# Altium project RK_NVR_DEMO1_RK3588_LP4XD200P232SD8_V21_20211228.PrjPcb (part 16 of 19)

## Sheet 83.SATA-SATA PM1.SchDoc
size 594 x 420 mm; Revision: V2.1; Schematic Page Number: 11; Page Number: 35; Check: Default; Schematic Name: RK_NVR_DEMO1_RK3588_LP4/4x_V21; Page Count: 43; Page name: 83.SATA-SATA PM1; Designer: Zhangdz; Schematic Page Count: 99; Revcode: V2.1; DsnPath: E:\Work\SBER\RK3588_SOM\temp\RK_NVR_DEMO1_RK3588_LP4XD200P232SD8_V21_20211228.DSN; SchematicName: RK_NVR_DEMO1_RK3588_LP4/4x_V21; PageName: 83.SATA-SATA PM1; PageSize: A2; TopSchematic: True
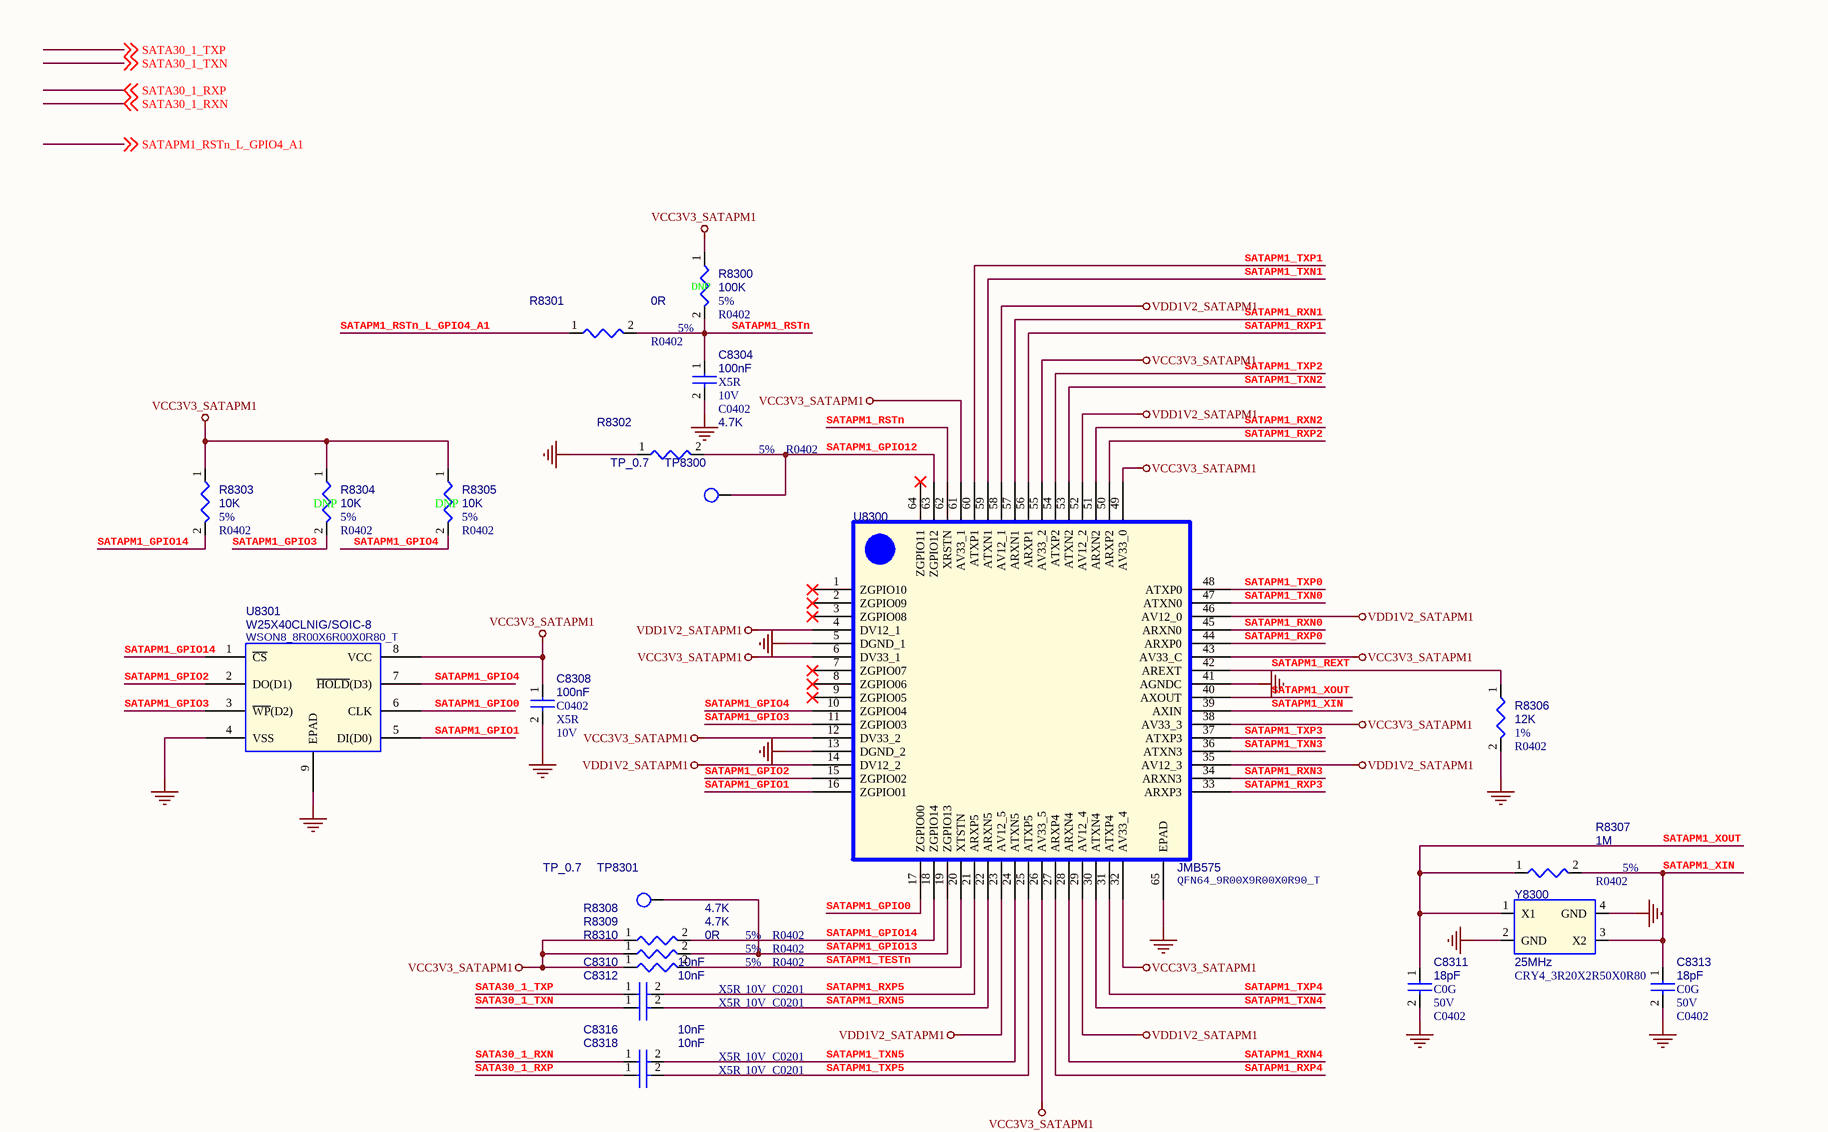
[diagram p65: 83.SATA-SATA PM1.SchDoc, top left]
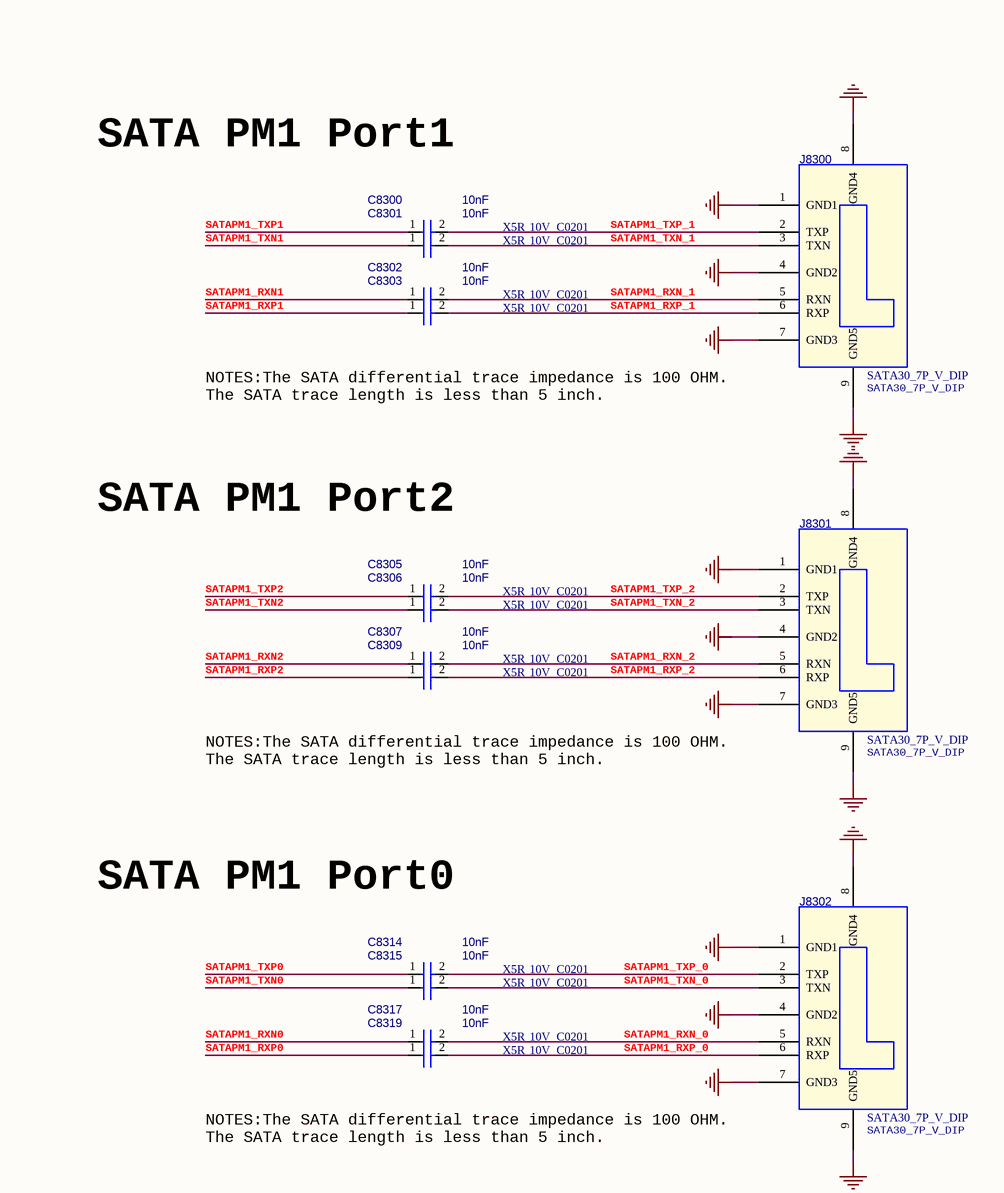
[diagram p66: 83.SATA-SATA PM1.SchDoc, top right]
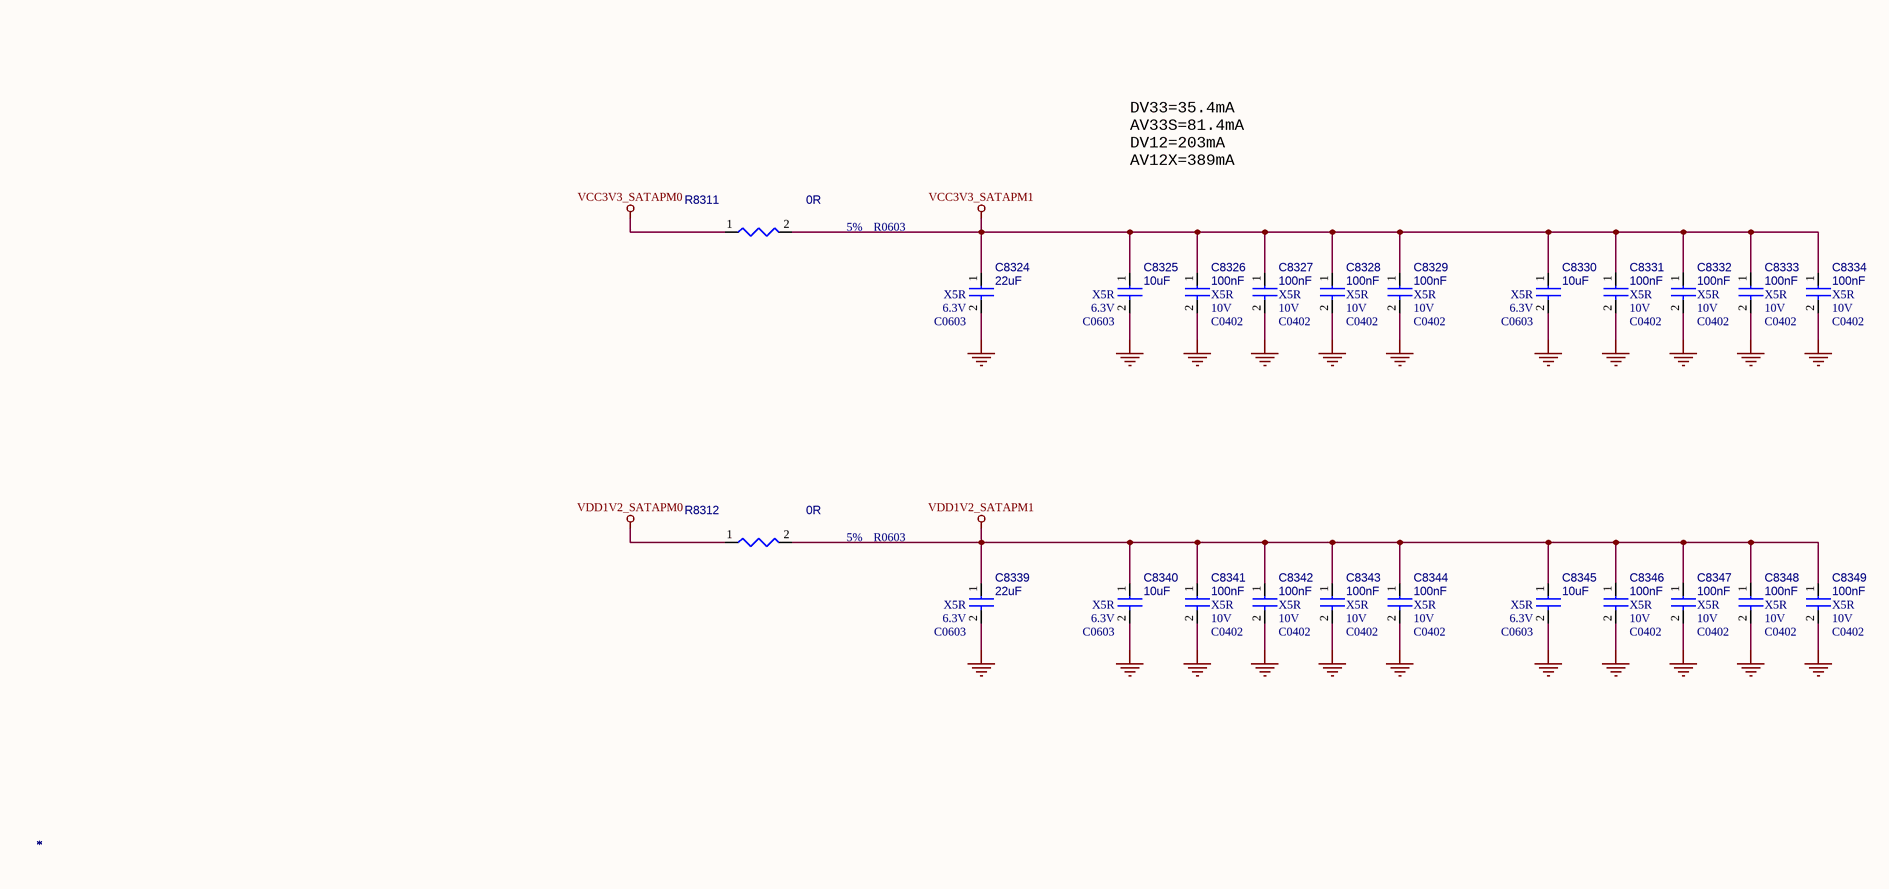
[diagram p67: 83.SATA-SATA PM1.SchDoc, bottom left]
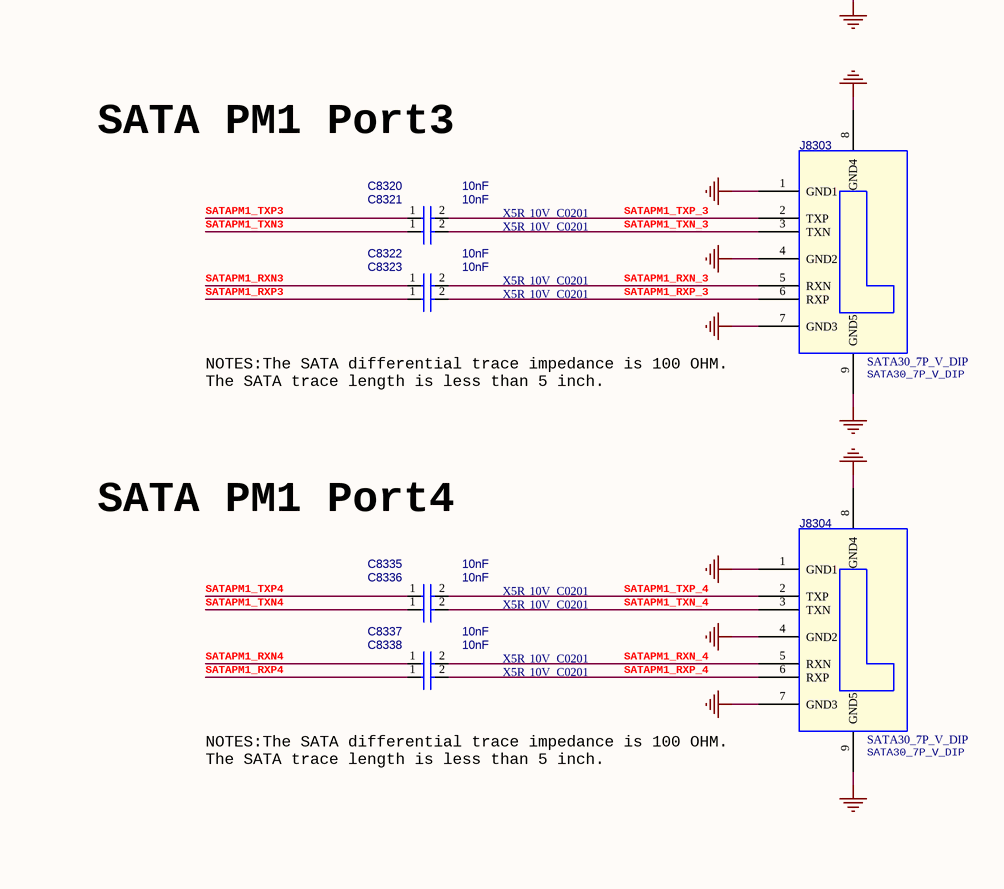
[diagram p68: 83.SATA-SATA PM1.SchDoc, bottom right]

### Parts
C8300  *  Voltage: 10V  Dielectric: X5R  [C0201]
C8301  *  Voltage: 10V  Dielectric: X5R  [C0201]
C8302  *  Voltage: 10V  Dielectric: X5R  [C0201]
C8303  *  Voltage: 10V  Dielectric: X5R  [C0201]
C8304  *  Voltage: 10V  Dielectric: X5R  [C0402]
C8305  *  Voltage: 10V  Dielectric: X5R  [C0201]
C8306  *  Voltage: 10V  Dielectric: X5R  [C0201]
C8307  *  Voltage: 10V  Dielectric: X5R  [C0201]
C8308  *  Voltage: 10V  Dielectric: X5R  [C0402]
C8309  *  Voltage: 10V  Dielectric: X5R  [C0201]
C8310  *  Voltage: 10V  Dielectric: X5R  [C0201]
C8311  *  Voltage: 50V  Dielectric: C0G  [C0402]
C8312  *  Voltage: 10V  Dielectric: X5R  [C0201]
C8313  *  Voltage: 50V  Dielectric: C0G  [C0402]
C8314  *  Voltage: 10V  Dielectric: X5R  [C0201]
C8315  *  Voltage: 10V  Dielectric: X5R  [C0201]
C8316  *  Voltage: 10V  Dielectric: X5R  [C0201]
C8317  *  Voltage: 10V  Dielectric: X5R  [C0201]
C8318  *  Voltage: 10V  Dielectric: X5R  [C0201]
C8319  *  Voltage: 10V  Dielectric: X5R  [C0201]
C8320  *  Voltage: 10V  Dielectric: X5R  [C0201]
C8321  *  Voltage: 10V  Dielectric: X5R  [C0201]
C8322  *  Voltage: 10V  Dielectric: X5R  [C0201]
C8323  *  Voltage: 10V  Dielectric: X5R  [C0201]
C8324  *  Voltage: 6.3V  Dielectric: X5R  [C0603]
C8325  *  Voltage: 6.3V  Dielectric: X5R  [C0603]
C8326  *  Voltage: 10V  Dielectric: X5R  [C0402]
C8327  *  Voltage: 10V  Dielectric: X5R  [C0402]
C8328  *  Voltage: 10V  Dielectric: X5R  [C0402]
C8329  *  Voltage: 10V  Dielectric: X5R  [C0402]
C8330  *  Voltage: 6.3V  Dielectric: X5R  [C0603]
C8331  *  Voltage: 10V  Dielectric: X5R  [C0402]
C8332  *  Voltage: 10V  Dielectric: X5R  [C0402]
C8333  *  Voltage: 10V  Dielectric: X5R  [C0402]
C8334  *  Voltage: 10V  Dielectric: X5R  [C0402]
C8335  *  Voltage: 10V  Dielectric: X5R  [C0201]
C8336  *  Voltage: 10V  Dielectric: X5R  [C0201]
C8337  *  Voltage: 10V  Dielectric: X5R  [C0201]
C8338  *  Voltage: 10V  Dielectric: X5R  [C0201]
C8339  *  Voltage: 6.3V  Dielectric: X5R  [C0603]
C8340  *  Voltage: 6.3V  Dielectric: X5R  [C0603]
C8341  *  Voltage: 10V  Dielectric: X5R  [C0402]
C8342  *  Voltage: 10V  Dielectric: X5R  [C0402]
C8343  *  Voltage: 10V  Dielectric: X5R  [C0402]
C8344  *  Voltage: 10V  Dielectric: X5R  [C0402]
C8345  *  Voltage: 6.3V  Dielectric: X5R  [C0603]
C8346  *  Voltage: 10V  Dielectric: X5R  [C0402]
C8347  *  Voltage: 10V  Dielectric: X5R  [C0402]
C8348  *  Voltage: 10V  Dielectric: X5R  [C0402]
C8349  *  Voltage: 10V  Dielectric: X5R  [C0402]
J8300  *  [SATA30_7P_V_DIP]
J8301  *  [SATA30_7P_V_DIP]
J8302  *  [SATA30_7P_V_DIP]
J8303  *  [SATA30_7P_V_DIP]
J8304  *  [SATA30_7P_V_DIP]
R8300  *  Tolerance: 5%  Option: DNP  [R0402]
R8301  *  Tolerance: 5%  [R0402]
R8302  *  Tolerance: 5%  [R0402]
R8303  *  Tolerance: 5%  [R0402]
R8304  *  Tolerance: 5%  Option: DNP  [R0402]
R8305  *  Tolerance: 5%  Option: DNP  [R0402]
R8306  *  Tolerance: 1%  [R0402]
R8307  *  Tolerance: 5%  [R0402]
R8308  *  Tolerance: 5%  [R0402]
R8309  *  Tolerance: 5%  [R0402]
R8310  *  Tolerance: 5%  [R0402]
R8311  *  PCB Footprint: R0603  Tolerance: 5%  [R0402]
R8312  *  PCB Footprint: R0603  Tolerance: 5%  [R0402]
TP8300  *  [TEST]
TP8301  *  [TEST]
U8300  *  PCB Footprint: QFN64_9R00X9R00X0R90_T  [QFN64]
U8301  *  [WSON8_8R00X6R00X0R80_T]
Y8300  *  PCB Footprint: CRY4_3R20X2R50X0R80  [CRY-3225]

### Nets
GND: C8304.2 C8308.2 C8311.2 C8313.2 C8324.2 C8325.2 C8326.2 C8327.2 C8328.2 C8329.2 C8330.2 C8331.2 C8332.2 C8333.2 C8334.2 C8339.2 C8340.2 C8341.2 C8342.2 C8343.2 C8344.2 C8345.2 C8346.2 C8347.2 C8348.2 C8349.2 J8300.1(GND1) J8300.4(GND2) J8300.7(GND3) J8300.8(GND4) J8300.9(GND5) J8301.1(GND1) J8301.4(GND2) J8301.7(GND3) J8301.8(GND4) J8301.9(GND5) J8302.1(GND1) J8302.4(GND2) J8302.7(GND3) J8302.8(GND4) J8302.9(GND5) J8303.1(GND1) J8303.4(GND2) J8303.7(GND3) J8303.8(GND4) J8303.9(GND5) J8304.1(GND1) J8304.4(GND2) J8304.7(GND3) J8304.8(GND4) J8304.9(GND5) R8302.1 R8306.2 U8300.5(DGND_1) U8300.13(DGND_2) U8300.41(AGNDC) U8300.65(EPAD) U8301.4(VSS) U8301.9(EPAD) Y8300.2(GND) Y8300.4(GND)
VCC3V3_SATAPM0: R8311.1
VCC3V3_SATAPM1: C8308.1 C8324.1 C8325.1 C8326.1 C8327.1 C8328.1 C8329.1 C8330.1 C8331.1 C8332.1 C8333.1 C8334.1 R8300.1 R8303.1 R8304.1 R8305.1 R8308.1 R8309.1 R8310.1 R8311.2 U8300.6(DV33_1) U8300.12(DV33_2) U8300.26(AV33_5) U8300.32(AV33_4) U8300.38(AV33_3) U8300.43(AV33_C) U8300.49(AV33_0) U8300.55(AV33_2) U8300.61(AV33_1) U8301.8(VCC)
VDD1V2_SATAPM0: R8312.1
VDD1V2_SATAPM1: C8339.1 C8340.1 C8341.1 C8342.1 C8343.1 C8344.1 C8345.1 C8346.1 C8347.1 C8348.1 C8349.1 R8312.2 U8300.4(DV12_1) U8300.14(DV12_2) U8300.23(AV12_5) U8300.29(AV12_4) U8300.35(AV12_3) U8300.46(AV12_0) U8300.52(AV12_2) U8300.58(AV12_1)
SATA30_1_RXN: C8316.1 ; off-sheet SATA30_1_RXN
SATA30_1_RXP: C8318.1 ; off-sheet SATA30_1_RXP
SATA30_1_TXN: C8312.1 ; off-sheet SATA30_1_TXN
SATA30_1_TXP: C8310.1 ; off-sheet SATA30_1_TXP
SATAPM1_GPIO0: U8300.17(ZGPIO00) U8301.6(CLK)
SATAPM1_GPIO1: U8300.16(ZGPIO01) U8301.5(DI(D0))
SATAPM1_GPIO2: U8300.15(ZGPIO02) U8301.2(DO(D1))
SATAPM1_GPIO3: R8304.2 U8300.11(ZGPIO03) U8301.3(~{WP}(D2))
SATAPM1_GPIO4: R8305.2 U8300.10(ZGPIO04) U8301.7(~{HOLD}(D3))
SATAPM1_GPIO12: R8302.2 TP8300.1 U8300.63(ZGPIO12)
SATAPM1_GPIO13: R8309.2 TP8301.1 U8300.19(ZGPIO13)
SATAPM1_GPIO14: R8303.2 R8308.2 U8300.18(ZGPIO14) U8301.1(~{CS})
SATAPM1_REXT: R8306.1 U8300.42(AREXT)
SATAPM1_RSTn: C8304.1 R8300.2 R8301.2 U8300.62(XRSTN)
SATAPM1_RSTn_L_GPIO4_A1: R8301.1 ; off-sheet SATAPM1_RSTn_L_GPIO4_A1
SATAPM1_RXN0: C8317.1 U8300.45(ARXN0)
SATAPM1_RXN1: C8302.1 U8300.57(ARXN1)
SATAPM1_RXN2: C8307.1 U8300.51(ARXN2)
SATAPM1_RXN3: C8322.1 U8300.34(ARXN3)
SATAPM1_RXN4: C8337.1 U8300.28(ARXN4)
SATAPM1_RXN5: C8312.2 U8300.22(ARXN5)
SATAPM1_RXN_0: C8317.2 J8302.5(RXN)
SATAPM1_RXN_1: C8302.2 J8300.5(RXN)
SATAPM1_RXN_2: C8307.2 J8301.5(RXN)
SATAPM1_RXN_3: C8322.2 J8303.5(RXN)
SATAPM1_RXN_4: C8337.2 J8304.5(RXN)
SATAPM1_RXP0: C8319.1 U8300.44(ARXP0)
SATAPM1_RXP1: C8303.1 U8300.56(ARXP1)
SATAPM1_RXP2: C8309.1 U8300.50(ARXP2)
SATAPM1_RXP3: C8323.1 U8300.33(ARXP3)
SATAPM1_RXP4: C8338.1 U8300.27(ARXP4)
SATAPM1_RXP5: C8310.2 U8300.21(ARXP5)
SATAPM1_RXP_0: C8319.2 J8302.6(RXP)
SATAPM1_RXP_1: C8303.2 J8300.6(RXP)
SATAPM1_RXP_2: C8309.2 J8301.6(RXP)
SATAPM1_RXP_3: C8323.2 J8303.6(RXP)
SATAPM1_RXP_4: C8338.2 J8304.6(RXP)
SATAPM1_TESTn: R8310.2 U8300.20(XTSTN)
SATAPM1_TXN0: C8315.1 U8300.47(ATXN0)
SATAPM1_TXN1: C8301.1 U8300.59(ATXN1)
SATAPM1_TXN2: C8306.1 U8300.53(ATXN2)
SATAPM1_TXN3: C8321.1 U8300.36(ATXN3)
SATAPM1_TXN4: C8336.1 U8300.30(ATXN4)
SATAPM1_TXN5: C8316.2 U8300.24(ATXN5)
SATAPM1_TXN_0: C8315.2 J8302.3(TXN)
SATAPM1_TXN_1: C8301.2 J8300.3(TXN)
SATAPM1_TXN_2: C8306.2 J8301.3(TXN)
SATAPM1_TXN_3: C8321.2 J8303.3(TXN)
SATAPM1_TXN_4: C8336.2 J8304.3(TXN)
SATAPM1_TXP0: C8314.1 U8300.48(ATXP0)
SATAPM1_TXP1: C8300.1 U8300.60(ATXP1)
SATAPM1_TXP2: C8305.1 U8300.54(ATXP2)
SATAPM1_TXP3: C8320.1 U8300.37(ATXP3)
SATAPM1_TXP4: C8335.1 U8300.31(ATXP4)
SATAPM1_TXP5: C8318.2 U8300.25(ATXP5)
SATAPM1_TXP_0: C8314.2 J8302.2(TXP)
SATAPM1_TXP_1: C8300.2 J8300.2(TXP)
SATAPM1_TXP_2: C8305.2 J8301.2(TXP)
SATAPM1_TXP_3: C8320.2 J8303.2(TXP)
SATAPM1_TXP_4: C8335.2 J8304.2(TXP)
SATAPM1_XIN: C8313.1 R8307.2 U8300.39(AXIN) Y8300.3(X2)
SATAPM1_XOUT: C8311.1 R8307.1 U8300.40(AXOUT) Y8300.1(X1)

Not connected (* = marked no-connect by the designer): U8300 1(ZGPIO10)* 2(ZGPIO09)* 3(ZGPIO08)* 7(ZGPIO07)* 8(ZGPIO06)* 9(ZGPIO05)* 64(ZGPIO11)*

### Notes on the sheet
- SATA PM1 Port1
- (near J8300) NOTES:The SATA differential trace impedance is 100 OHM.
  The SATA trace length is less than 5 inch.
- SATA PM1 Port2
- (near J8301) NOTES:The SATA differential trace impedance is 100 OHM.
  The SATA trace length is less than 5 inch.
- SATA PM1 Port0
- (near J8302) NOTES:The SATA differential trace impedance is 100 OHM.
  The SATA trace length is less than 5 inch.
- SATA PM1 Port3
- DV33=35.4mA
  AV33S=81.4mA
  DV12=203mA
  AV12X=389mA
- (near J8303) NOTES:The SATA differential trace impedance is 100 OHM.
  The SATA trace length is less than 5 inch.
- SATA PM1 Port4
- (near J8304) NOTES:The SATA differential trace impedance is 100 OHM.
  The SATA trace length is less than 5 inch.

### Library data of the parts
C8300 = CAP NP: cap,10.00nF,+/-10%,10V,X5R,C0201; Part Reference: C8300; Manufacturer PN: C0603X5R1A103K030BA; Manufacturer: TDK; Value: 10nF; Tolerance: 10%; Priority: A; PCB Footprint: C0201; Created by: JJJ; Part Type: C0201; RK PN: C0603X5R1A103K030BA
C8301 = CAP NP: cap,10.00nF,+/-10%,10V,X5R,C0201; Part Reference: C8301; Manufacturer PN: C0603X5R1A103K030BA; Manufacturer: TDK; Value: 10nF; Tolerance: 10%; Priority: A; PCB Footprint: C0201; Created by: JJJ; Part Type: C0201; RK PN: C0603X5R1A103K030BA
C8302 = CAP NP: cap,10.00nF,+/-10%,10V,X5R,C0201; Part Reference: C8302; Manufacturer PN: C0603X5R1A103K030BA; Manufacturer: TDK; Value: 10nF; Tolerance: 10%; Priority: A; PCB Footprint: C0201; Created by: JJJ; Part Type: C0201; RK PN: C0603X5R1A103K030BA
C8303 = CAP NP: cap,10.00nF,+/-10%,10V,X5R,C0201; Part Reference: C8303; Manufacturer PN: C0603X5R1A103K030BA; Manufacturer: TDK; Value: 10nF; Tolerance: 10%; Priority: A; PCB Footprint: C0201; Created by: JJJ; Part Type: C0201; RK PN: C0603X5R1A103K030BA
C8304 = CAP NP: cap,100.00nF,+/-10%,10V,X5R,C0402; Part Reference: C8304; Manufacturer: TDK; Value: 100nF; RK PN: C1005X5R1A104K050BA; Priority: A; Tolerance: 10%; PCB Footprint: C0402; Part Type: C0402; Manufacturer PN: C1005X5R1A104K050BA; Created by: JJJ
C8305 = CAP NP: cap,10.00nF,+/-10%,10V,X5R,C0201; Part Reference: C8305; Manufacturer PN: C0603X5R1A103K030BA; Manufacturer: TDK; Value: 10nF; Tolerance: 10%; Priority: A; PCB Footprint: C0201; Created by: JJJ; Part Type: C0201; RK PN: C0603X5R1A103K030BA
C8306 = CAP NP: cap,10.00nF,+/-10%,10V,X5R,C0201; Part Reference: C8306; Manufacturer PN: C0603X5R1A103K030BA; Manufacturer: TDK; Value: 10nF; Tolerance: 10%; Priority: A; PCB Footprint: C0201; Created by: JJJ; Part Type: C0201; RK PN: C0603X5R1A103K030BA
C8307 = CAP NP: cap,10.00nF,+/-10%,10V,X5R,C0201; Part Reference: C8307; Manufacturer PN: C0603X5R1A103K030BA; Manufacturer: TDK; Value: 10nF; Tolerance: 10%; Priority: A; PCB Footprint: C0201; Created by: JJJ; Part Type: C0201; RK PN: C0603X5R1A103K030BA
C8308 = CAP NP: cap,100.00nF,+/-10%,10V,X5R,C0402; Part Reference: C8308; Manufacturer: TDK; Value: 100nF; RK PN: C1005X5R1A104K050BA; Priority: A; Tolerance: 10%; PCB Footprint: C0402; Part Type: C0402; Manufacturer PN: C1005X5R1A104K050BA; Created by: JJJ
C8309 = CAP NP: cap,10.00nF,+/-10%,10V,X5R,C0201; Part Reference: C8309; Manufacturer PN: C0603X5R1A103K030BA; Manufacturer: TDK; Value: 10nF; Tolerance: 10%; Priority: A; PCB Footprint: C0201; Created by: JJJ; Part Type: C0201; RK PN: C0603X5R1A103K030BA
C8310 = CAP NP: cap,10.00nF,+/-10%,10V,X5R,C0201; Part Reference: C8310; Manufacturer: TDK; Value: 10nF; RK PN: C0603X5R1A103K030BA; Priority: A; Tolerance: 10%; PCB Footprint: C0201; Part Type: C0201; Manufacturer PN: C0603X5R1A103K030BA; Created by: JJJ
C8311 = CAP NP: cap,18.00pF,+/-5%,50V,C0G,C0402; Part Reference: C8311; Manufacturer: TDK; Value: 18pF; RK PN: C1005C0G1H180J050BA; Priority: A; Tolerance: 5%; PCB Footprint: C0402; Part Type: C0402; Manufacturer PN: C1005C0G1H180J050BA; Created by: JJJ
C8312 = CAP NP: cap,10.00nF,+/-10%,10V,X5R,C0201; Part Reference: C8312; Manufacturer: TDK; Value: 10nF; RK PN: C0603X5R1A103K030BA; Priority: A; Tolerance: 10%; PCB Footprint: C0201; Part Type: C0201; Manufacturer PN: C0603X5R1A103K030BA; Created by: JJJ
C8313 = CAP NP: cap,18.00pF,+/-5%,50V,C0G,C0402; Part Reference: C8313; Manufacturer: TDK; Value: 18pF; RK PN: C1005C0G1H180J050BA; Priority: A; Tolerance: 5%; PCB Footprint: C0402; Part Type: C0402; Manufacturer PN: C1005C0G1H180J050BA; Created by: JJJ
C8314 = CAP NP: cap,10.00nF,+/-10%,10V,X5R,C0201; Part Reference: C8314; Manufacturer PN: C0603X5R1A103K030BA; Manufacturer: TDK; Value: 10nF; Tolerance: 10%; Priority: A; PCB Footprint: C0201; Created by: JJJ; Part Type: C0201; RK PN: C0603X5R1A103K030BA
C8315 = CAP NP: cap,10.00nF,+/-10%,10V,X5R,C0201; Part Reference: C8315; Manufacturer PN: C0603X5R1A103K030BA; Manufacturer: TDK; Value: 10nF; Tolerance: 10%; Priority: A; PCB Footprint: C0201; Created by: JJJ; Part Type: C0201; RK PN: C0603X5R1A103K030BA
C8316 = CAP NP: cap,10.00nF,+/-10%,10V,X5R,C0201; Part Reference: C8316; Manufacturer: TDK; Value: 10nF; RK PN: C0603X5R1A103K030BA; Priority: A; Tolerance: 10%; PCB Footprint: C0201; Part Type: C0201; Manufacturer PN: C0603X5R1A103K030BA; Created by: JJJ
C8317 = CAP NP: cap,10.00nF,+/-10%,10V,X5R,C0201; Part Reference: C8317; Manufacturer PN: C0603X5R1A103K030BA; Manufacturer: TDK; Value: 10nF; Tolerance: 10%; Priority: A; PCB Footprint: C0201; Created by: JJJ; Part Type: C0201; RK PN: C0603X5R1A103K030BA
C8318 = CAP NP: cap,10.00nF,+/-10%,10V,X5R,C0201; Part Reference: C8318; Manufacturer: TDK; Value: 10nF; RK PN: C0603X5R1A103K030BA; Priority: A; Tolerance: 10%; PCB Footprint: C0201; Part Type: C0201; Manufacturer PN: C0603X5R1A103K030BA; Created by: JJJ
C8319 = CAP NP: cap,10.00nF,+/-10%,10V,X5R,C0201; Part Reference: C8319; Manufacturer PN: C0603X5R1A103K030BA; Manufacturer: TDK; Value: 10nF; Tolerance: 10%; Priority: A; PCB Footprint: C0201; Created by: JJJ; Part Type: C0201; RK PN: C0603X5R1A103K030BA
C8320 = CAP NP: cap,10.00nF,+/-10%,10V,X5R,C0201; Part Reference: C8320; Manufacturer PN: C0603X5R1A103K030BA; Manufacturer: TDK; Value: 10nF; Tolerance: 10%; Priority: A; PCB Footprint: C0201; Created by: JJJ; Part Type: C0201; RK PN: C0603X5R1A103K030BA
C8321 = CAP NP: cap,10.00nF,+/-10%,10V,X5R,C0201; Part Reference: C8321; Manufacturer PN: C0603X5R1A103K030BA; Manufacturer: TDK; Value: 10nF; Tolerance: 10%; Priority: A; PCB Footprint: C0201; Created by: JJJ; Part Type: C0201; RK PN: C0603X5R1A103K030BA
C8322 = CAP NP: cap,10.00nF,+/-10%,10V,X5R,C0201; Part Reference: C8322; Manufacturer PN: C0603X5R1A103K030BA; Manufacturer: TDK; Value: 10nF; Tolerance: 10%; Priority: A; PCB Footprint: C0201; Created by: JJJ; Part Type: C0201; RK PN: C0603X5R1A103K030BA
C8323 = CAP NP: cap,10.00nF,+/-10%,10V,X5R,C0201; Part Reference: C8323; Manufacturer PN: C0603X5R1A103K030BA; Manufacturer: TDK; Value: 10nF; Tolerance: 10%; Priority: A; PCB Footprint: C0201; Created by: JJJ; Part Type: C0201; RK PN: C0603X5R1A103K030BA
C8324 = CAP NP: cap,22.00uF,+/-20%,6.3V,X5R,C0603; Part Reference: C8324; Manufacturer PN: C1608X5R0J226M080AC; Manufacturer: TDK; Value: 22uF; Tolerance: 20%; Priority: A; PCB Footprint: C0603; Created by: JJJ; C_Voltage: 6.3V; Part Type: C0603; RK PN: C1608X5R0J226M080AC
C8325 = CAP NP: cap,10.00uF,+/-10%,6.3V,X5R,C0603; Part Reference: C8325; Manufacturer: TDK; Value: 10uF; RK PN: C1608X5R0J106K080AB; Priority: A; Tolerance: 10%; PCB Footprint: C0603; Part Type: C0603; C_Voltage: 6.3V; Manufacturer PN: C1608X5R0J106K080AB; Created by: JJJ
C8326 = CAP NP: cap,100.00nF,+/-10%,10V,X5R,C0402; Part Reference: C8326; Manufacturer PN: C1005X5R1A104K050BA; Manufacturer: TDK; Value: 100nF; C_Voltage: 6.3V; Tolerance: 10%; Priority: A; Number: 37; PCB Footprint: C0402; Created by: JJJ; Part Type: C0402; RK PN: C1005X5R1A104K050BA
C8327 = CAP NP: cap,100.00nF,+/-10%,10V,X5R,C0402; Part Reference: C8327; Manufacturer PN: C1005X5R1A104K050BA; Manufacturer: TDK; Value: 100nF; C_Voltage: 6.3V; Tolerance: 10%; Priority: A; Number: 37; PCB Footprint: C0402; Created by: JJJ; Part Type: C0402; RK PN: C1005X5R1A104K050BA
C8328 = CAP NP: cap,100.00nF,+/-10%,10V,X5R,C0402; Part Reference: C8328; Manufacturer PN: C1005X5R1A104K050BA; Manufacturer: TDK; Value: 100nF; C_Voltage: 6.3V; Tolerance: 10%; Priority: A; Number: 37; PCB Footprint: C0402; Created by: JJJ; Part Type: C0402; RK PN: C1005X5R1A104K050BA
C8329 = CAP NP: cap,100.00nF,+/-10%,10V,X5R,C0402; Part Reference: C8329; Manufacturer PN: C1005X5R1A104K050BA; Manufacturer: TDK; Value: 100nF; C_Voltage: 6.3V; Tolerance: 10%; Priority: A; Number: 37; PCB Footprint: C0402; Created by: JJJ; Part Type: C0402; RK PN: C1005X5R1A104K050BA
C8330 = CAP NP: cap,10.00uF,+/-10%,6.3V,X5R,C0603; Part Reference: C8330; Manufacturer: TDK; Value: 10uF; RK PN: C1608X5R0J106K080AB; Priority: A; Tolerance: 10%; PCB Footprint: C0603; Part Type: C0603; C_Voltage: 6.3V; Manufacturer PN: C1608X5R0J106K080AB; Created by: JJJ
C8331 = CAP NP: cap,100.00nF,+/-10%,10V,X5R,C0402; Part Reference: C8331; Manufacturer PN: C1005X5R1A104K050BA; Manufacturer: TDK; Value: 100nF; C_Voltage: 6.3V; Tolerance: 10%; Priority: A; Number: 37; PCB Footprint: C0402; Created by: JJJ; Part Type: C0402; RK PN: C1005X5R1A104K050BA
C8332 = CAP NP: cap,100.00nF,+/-10%,10V,X5R,C0402; Part Reference: C8332; Manufacturer PN: C1005X5R1A104K050BA; Manufacturer: TDK; Value: 100nF; C_Voltage: 6.3V; Tolerance: 10%; Priority: A; Number: 37; PCB Footprint: C0402; Created by: JJJ; Part Type: C0402; RK PN: C1005X5R1A104K050BA
C8333 = CAP NP: cap,100.00nF,+/-10%,10V,X5R,C0402; Part Reference: C8333; Manufacturer PN: C1005X5R1A104K050BA; Manufacturer: TDK; Value: 100nF; C_Voltage: 6.3V; Tolerance: 10%; Priority: A; Number: 37; PCB Footprint: C0402; Created by: JJJ; Part Type: C0402; RK PN: C1005X5R1A104K050BA
C8334 = CAP NP: cap,100.00nF,+/-10%,10V,X5R,C0402; Part Reference: C8334; Manufacturer PN: C1005X5R1A104K050BA; Manufacturer: TDK; Value: 100nF; C_Voltage: 6.3V; Tolerance: 10%; Priority: A; Number: 37; PCB Footprint: C0402; Created by: JJJ; Part Type: C0402; RK PN: C1005X5R1A104K050BA
C8335 = CAP NP: cap,10.00nF,+/-10%,10V,X5R,C0201; Part Reference: C8335; Manufacturer PN: C0603X5R1A103K030BA; Manufacturer: TDK; Value: 10nF; Tolerance: 10%; Priority: A; PCB Footprint: C0201; Created by: JJJ; Part Type: C0201; RK PN: C0603X5R1A103K030BA
C8336 = CAP NP: cap,10.00nF,+/-10%,10V,X5R,C0201; Part Reference: C8336; Manufacturer PN: C0603X5R1A103K030BA; Manufacturer: TDK; Value: 10nF; Tolerance: 10%; Priority: A; PCB Footprint: C0201; Created by: JJJ; Part Type: C0201; RK PN: C0603X5R1A103K030BA
C8337 = CAP NP: cap,10.00nF,+/-10%,10V,X5R,C0201; Part Reference: C8337; Manufacturer PN: C0603X5R1A103K030BA; Manufacturer: TDK; Value: 10nF; Tolerance: 10%; Priority: A; PCB Footprint: C0201; Created by: JJJ; Part Type: C0201; RK PN: C0603X5R1A103K030BA
C8338 = CAP NP: cap,10.00nF,+/-10%,10V,X5R,C0201; Part Reference: C8338; Manufacturer PN: C0603X5R1A103K030BA; Manufacturer: TDK; Value: 10nF; Tolerance: 10%; Priority: A; PCB Footprint: C0201; Created by: JJJ; Part Type: C0201; RK PN: C0603X5R1A103K030BA
C8339 = CAP NP: cap,22.00uF,+/-20%,6.3V,X5R,C0603; Part Reference: C8339; Manufacturer: TDK; Value: 22uF; RK PN: C1608X5R0J226M080AC; Priority: A; Tolerance: 20%; PCB Footprint: C0603; Part Type: C0603; C_Voltage: 6.3V; Manufacturer PN: C1608X5R0J226M080AC; Created by: JJJ
C8340 = CAP NP: cap,10.00uF,+/-10%,6.3V,X5R,C0603; Part Reference: C8340; Manufacturer: TDK; Value: 10uF; RK PN: C1608X5R0J106K080AB; Priority: A; Tolerance: 10%; PCB Footprint: C0603; Part Type: C0603; C_Voltage: 6.3V; Manufacturer PN: C1608X5R0J106K080AB; Created by: JJJ
C8341 = CAP NP: cap,100.00nF,+/-10%,10V,X5R,C0402; Part Reference: C8341; Manufacturer PN: C1005X5R1A104K050BA; Manufacturer: TDK; Value: 100nF; C_Voltage: 6.3V; Tolerance: 10%; Priority: A; Number: 37; PCB Footprint: C0402; Created by: JJJ; Part Type: C0402; RK PN: C1005X5R1A104K050BA
C8342 = CAP NP: cap,100.00nF,+/-10%,10V,X5R,C0402; Part Reference: C8342; Manufacturer PN: C1005X5R1A104K050BA; Manufacturer: TDK; Value: 100nF; C_Voltage: 6.3V; Tolerance: 10%; Priority: A; Number: 37; PCB Footprint: C0402; Created by: JJJ; Part Type: C0402; RK PN: C1005X5R1A104K050BA
C8343 = CAP NP: cap,100.00nF,+/-10%,10V,X5R,C0402; Part Reference: C8343; Manufacturer PN: C1005X5R1A104K050BA; Manufacturer: TDK; Value: 100nF; C_Voltage: 6.3V; Tolerance: 10%; Priority: A; Number: 37; PCB Footprint: C0402; Created by: JJJ; Part Type: C0402; RK PN: C1005X5R1A104K050BA
C8344 = CAP NP: cap,100.00nF,+/-10%,10V,X5R,C0402; Part Reference: C8344; Manufacturer PN: C1005X5R1A104K050BA; Manufacturer: TDK; Value: 100nF; C_Voltage: 6.3V; Tolerance: 10%; Priority: A; Number: 37; PCB Footprint: C0402; Created by: JJJ; Part Type: C0402; RK PN: C1005X5R1A104K050BA
C8345 = CAP NP: cap,10.00uF,+/-10%,6.3V,X5R,C0603; Part Reference: C8345; Manufacturer: TDK; Value: 10uF; RK PN: C1608X5R0J106K080AB; Priority: A; Tolerance: 10%; PCB Footprint: C0603; Part Type: C0603; C_Voltage: 6.3V; Manufacturer PN: C1608X5R0J106K080AB; Created by: JJJ
C8346 = CAP NP: cap,100.00nF,+/-10%,10V,X5R,C0402; Part Reference: C8346; Manufacturer PN: C1005X5R1A104K050BA; Manufacturer: TDK; Value: 100nF; C_Voltage: 6.3V; Tolerance: 10%; Priority: A; Number: 37; PCB Footprint: C0402; Created by: JJJ; Part Type: C0402; RK PN: C1005X5R1A104K050BA
C8347 = CAP NP: cap,100.00nF,+/-10%,10V,X5R,C0402; Part Reference: C8347; Manufacturer PN: C1005X5R1A104K050BA; Manufacturer: TDK; Value: 100nF; C_Voltage: 6.3V; Tolerance: 10%; Priority: A; Number: 37; PCB Footprint: C0402; Created by: JJJ; Part Type: C0402; RK PN: C1005X5R1A104K050BA
C8348 = CAP NP: cap,100.00nF,+/-10%,10V,X5R,C0402; Part Reference: C8348; Manufacturer PN: C1005X5R1A104K050BA; Manufacturer: TDK; Value: 100nF; C_Voltage: 6.3V; Tolerance: 10%; Priority: A; Number: 37; PCB Footprint: C0402; Created by: JJJ; Part Type: C0402; RK PN: C1005X5R1A104K050BA
C8349 = CAP NP: cap,100.00nF,+/-10%,10V,X5R,C0402; Part Reference: C8349; Manufacturer PN: C1005X5R1A104K050BA; Manufacturer: TDK; Value: 100nF; C_Voltage: 6.3V; Tolerance: 10%; Priority: A; Number: 37; PCB Footprint: C0402; Created by: JJJ; Part Type: C0402; RK PN: C1005X5R1A104K050BA
J8300 = SATA_DIP_0: Part Reference: J8300; Value: SATA30_7P_V_DIP; PCB Footprint: SATA30_7P_V_DIP
J8301 = SATA_DIP_0: Part Reference: J8301; Value: SATA30_7P_V_DIP; PCB Footprint: SATA30_7P_V_DIP
J8302 = SATA_DIP_0: Part Reference: J8302; Value: SATA30_7P_V_DIP; PCB Footprint: SATA30_7P_V_DIP
J8303 = SATA_DIP_0: Part Reference: J8303; Value: SATA30_7P_V_DIP; PCB Footprint: SATA30_7P_V_DIP
J8304 = SATA_DIP_0: Part Reference: J8304; Value: SATA30_7P_V_DIP; PCB Footprint: SATA30_7P_V_DIP
R8300 = RESISTOR_Dup1: НЁУГєсД¤µзЧи,100K,+/-5%,R0402,1/16W.; Part Reference: R8300; Manufacturer PN: RC0402JR-07100KL; Manufacturer: YAGEO; Wattage: 1/16W; Priority: A; PCB Footprint: R0402; Value: 100K; Created by: YTL; Part Type: НЁУГєсД¤µзЧи; RK PN: RC0402JR-07100KL
R8301 = RESISTOR_Dup1: НЁУГєсД¤µзЧи,0R,+/-5%,R0402,1/16W.; Part Reference: R8301; Manufacturer: YAGEO; RK PN: RC0402JR-070RL; Priority: A; Wattage: 1/16W; PCB Footprint: R0402; Value: 0R; Part Type: НЁУГєсД¤µзЧи; Manufacturer PN: RC0402JR-070RL; Created by: YTL
R8302 = RESISTOR_Dup1: НЁУГєсД¤µзЧи,4K7,+/-5%,R0402,1/16W.; Part Reference: R8302; Manufacturer: YAGEO; Value: 4.7K; RK PN: RC0402JR-074K7L; Priority: A; Wattage: 1/16W; PCB Footprint: R0402; Part Type: НЁУГєсД¤µзЧи; Manufacturer PN: RC0402JR-074K7L; Created by: YTL
R8303 = RESISTOR_Dup1: НЁУГєсД¤µзЧи,10K,+/-5%,R0402,1/16W.; Part Reference: R8303; Manufacturer PN: RC0402JR-0710KL; Manufacturer: YAGEO; Wattage: 1/16W; Priority: A; PCB Footprint: R0402; Value: 10K; Created by: YTL; Part Type: НЁУГєсД¤µзЧи; RK PN: RC0402JR-0710KL
R8304 = RESISTOR_Dup1: НЁУГєсД¤µзЧи,10K,+/-5%,R0402,1/16W.; Part Reference: R8304; Manufacturer: YAGEO; RK PN: RC0402JR-0710KL; Priority: A; Wattage: 1/16W; PCB Footprint: R0402; Value: 10K; Part Type: НЁУГєсД¤µзЧи; Manufacturer PN: RC0402JR-0710KL; Created by: YTL
R8305 = RESISTOR_Dup1: НЁУГєсД¤µзЧи,10K,+/-5%,R0402,1/16W.; Part Reference: R8305; Manufacturer: YAGEO; RK PN: RC0402JR-0710KL; Priority: A; Wattage: 1/16W; PCB Footprint: R0402; Value: 10K; Part Type: НЁУГєсД¤µзЧи; Manufacturer PN: RC0402JR-0710KL; Created by: YTL
R8306 = RESISTOR_Dup1: НЁУГєсД¤µзЧи,12K,+/-1%,R0402,1/16W.; Part Reference: R8306; Manufacturer PN: RC0402FR-0712KL; Manufacturer: YAGEO; Wattage: 1/16W; Priority: A; PCB Footprint: R0402; Value: 12K; Created by: YTL; Part Type: НЁУГєсД¤µзЧи; RK PN: RC0402FR-0712KL
R8307 = RESISTOR_Dup1: НЁУГєсД¤µзЧи,1M,+/-5%,R0402,1/16W.; Part Reference: R8307; Manufacturer: YAGEO; RK PN: RC0402JR-071ML; Priority: A; Wattage: 1/16W; PCB Footprint: R0402; Value: 1M; Part Type: НЁУГєсД¤µзЧи; Manufacturer PN: RC0402JR-071ML; Created by: YTL
R8308 = RESISTOR_Dup1: НЁУГєсД¤µзЧи,4K7,+/-5%,R0402,1/16W.; Part Reference: R8308; Manufacturer: YAGEO; Value: 4.7K; RK PN: RC0402JR-074K7L; Priority: A; Wattage: 1/16W; PCB Footprint: R0402; Part Type: НЁУГєсД¤µзЧи; Manufacturer PN: RC0402JR-074K7L; Created by: YTL
R8309 = RESISTOR_Dup1: НЁУГєсД¤µзЧи,4K7,+/-5%,R0402,1/16W.; Part Reference: R8309; Manufacturer PN: RC0402JR-074K7L; Manufacturer: YAGEO; Value: 4.7K; Wattage: 1/16W; Priority: A; PCB Footprint: R0402; Created by: YTL; Part Type: НЁУГєсД¤µзЧи; RK PN: RC0402JR-074K7L
R8310 = RESISTOR_Dup1: НЁУГєсД¤µзЧи,0R,+/-5%,R0402,1/16W.; Part Reference: R8310; Manufacturer: YAGEO; RK PN: RC0402JR-070RL; Priority: A; Wattage: 1/16W; PCB Footprint: R0402; Value: 0R; Part Type: НЁУГєсД¤µзЧи; Manufacturer PN: RC0402JR-070RL; Created by: YTL
R8311 = RESISTOR_Dup1: НЁУГєсД¤µзЧи,0R,+/-5%,R0603,1/10W.; Part Reference: R8311; Manufacturer PN: RC0603JR-070RL; Manufacturer: YAGEO; Wattage: 1/10W; Priority: A; Value: 0R; Created by: YTL; Part Type: НЁУГєсД¤µзЧи; RK PN: RC0603JR-070RL
R8312 = RESISTOR_Dup1: НЁУГєсД¤µзЧи,0R,+/-5%,R0603,1/10W.; Part Reference: R8312; Manufacturer PN: RC0603JR-070RL; Manufacturer: YAGEO; Wattage: 1/10W; Priority: A; Value: 0R; Created by: YTL; Part Type: НЁУГєсД¤µзЧи; RK PN: RC0603JR-070RL
TP8300 = TP: Test Point 0.7mm; Part Reference: TP8300; PCB Footprint: TP_0R70; Value: TP_0.7; Priority: A; RK PN: TESTPOINT_0R7; Created by: JJJ; Part Type: TP
TP8301 = TP: Test Point 0.7mm; Part Reference: TP8301; PCB Footprint: TP_0R70; Value: TP_0.7; RK PN: TESTPOINT_0R7; Priority: A; Part Type: TP; Created by: JJJ
U8300 = JMB575: Part Reference: U8300; Value: JMB575
U8301 = SPI_FLASH_8PIN_T_0: 256M-bit Serial Flash;32M-byte;3.3V Uniform Sector;Dual and Quad Serial Flash;; Part Reference: U8301; Manufacturer: GigaDevice; Value: W25X40CLNIG/SOIC-8; RK PN: GD25Q256CYGR; Priority: A; PCB Footprint: WSON8_8R00X6R00X0R80_T; Part Type: SPI_FLASH; Manufacturer PN: GD25Q256CYGR; Created by: JJJ
Y8300 = CRYSTAL_4P: ОЮФґѕ§ХсЈ¬25MЈ¬3225,ЎА10ppmЈ¬10pFЈ¬Hosonic; Part Reference: Y8300; Manufacturer PN: E3SB25.0000F10E11; Manufacturer: Hosonic(єиРЗµзЧУ); Value: 25MHz; Priority: A; Created by: JJJ; Part Type: CRYSTAL; RK PN: E3SB25.0000F10E11